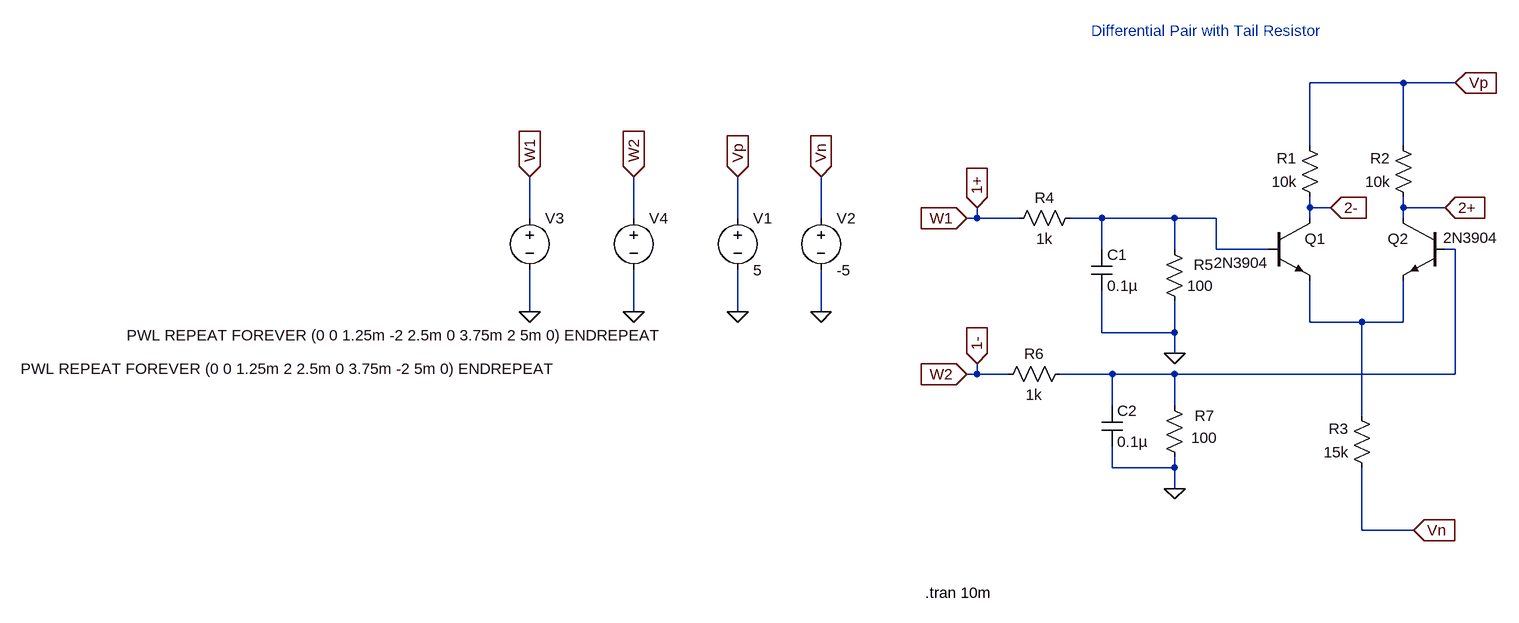
[diagram p0: schematic diff_pair_tail_res_ltspice.asc]
diff_pair_tail_res_ltspice.asc, the LTspice schematic file:
Version 4
SHEET 1 1032 680
WIRE 864 -208 720 -208
WIRE 944 -208 864 -208
WIRE 720 -112 720 -208
WIRE 864 -112 864 -208
WIRE 720 -16 720 -32
WIRE 752 -16 720 -16
WIRE 864 -16 864 -32
WIRE 928 -16 864 -16
WIRE -480 0 -480 -64
WIRE -320 0 -320 -64
WIRE -160 0 -160 -64
WIRE -32 0 -32 -64
WIRE 208 0 208 -16
WIRE 208 0 192 0
WIRE 272 0 208 0
WIRE 400 0 352 0
WIRE 512 0 400 0
WIRE 576 0 512 0
WIRE 720 0 720 -16
WIRE 864 0 864 -16
WIRE 400 48 400 0
WIRE 512 48 512 0
WIRE 576 48 576 0
WIRE 656 48 576 48
WIRE 944 48 928 48
WIRE -480 144 -480 80
WIRE -320 144 -320 80
WIRE -160 144 -160 80
WIRE -32 144 -32 80
WIRE 720 160 720 96
WIRE 800 160 720 160
WIRE 864 160 864 96
WIRE 864 160 800 160
WIRE 400 176 400 112
WIRE 512 176 512 128
WIRE 512 176 400 176
WIRE 512 208 512 176
WIRE 208 240 208 224
WIRE 208 240 192 240
WIRE 256 240 208 240
WIRE 416 240 336 240
WIRE 512 240 416 240
WIRE 944 240 944 48
WIRE 944 240 512 240
WIRE 416 288 416 240
WIRE 512 288 512 240
WIRE 800 304 800 160
WIRE 416 384 416 352
WIRE 512 384 512 368
WIRE 512 384 416 384
WIRE 512 416 512 384
WIRE 800 480 800 384
WIRE 880 480 800 480
FLAG 512 208 0
FLAG 512 416 0
FLAG 944 -208 Vp
IOPIN 944 -208 In
FLAG 880 480 Vn
IOPIN 880 480 In
FLAG 192 0 W1
IOPIN 192 0 In
FLAG 192 240 W2
IOPIN 192 240 In
FLAG -160 144 0
FLAG -32 144 0
FLAG -480 144 0
FLAG -320 144 0
FLAG -160 -64 Vp
IOPIN -160 -64 In
FLAG -32 -64 Vn
IOPIN -32 -64 In
FLAG -480 -64 W1
IOPIN -480 -64 In
FLAG -320 -64 W2
IOPIN -320 -64 In
FLAG 928 -16 2+
IOPIN 928 -16 In
FLAG 208 -16 1+
IOPIN 208 -16 In
FLAG 208 224 1-
IOPIN 208 224 In
FLAG 752 -16 2-
IOPIN 752 -16 In
SYMBOL res 736 -16 R180
WINDOW 0 36 76 Left 2
WINDOW 3 36 40 Left 2
SYMATTR InstName R1
SYMATTR Value 10k
SYMBOL res 880 -16 R180
WINDOW 0 36 76 Left 2
WINDOW 3 36 40 Left 2
SYMATTR InstName R2
SYMATTR Value 10k
SYMBOL res 816 400 R180
WINDOW 0 36 76 Left 2
WINDOW 3 36 40 Left 2
SYMATTR InstName R3
SYMATTR Value 15k
SYMBOL res 256 16 R270
WINDOW 0 32 56 VTop 2
WINDOW 3 0 56 VBottom 2
SYMATTR InstName R4
SYMATTR Value 1k
SYMBOL res 528 144 R180
WINDOW 0 -44 72 Left 2
WINDOW 3 -44 40 Left 2
SYMATTR InstName R5
SYMATTR Value 100
SYMBOL res 240 256 R270
WINDOW 0 32 56 VTop 2
WINDOW 3 0 56 VBottom 2
SYMATTR InstName R6
SYMATTR Value 1k
SYMBOL res 528 384 R180
WINDOW 0 -46 80 Left 2
WINDOW 3 -50 46 Left 2
SYMATTR InstName R7
SYMATTR Value 100
SYMBOL npn 656 0 R0
WINDOW 3 -84 69 Left 2
SYMATTR Value 2N3904
SYMATTR InstName Q1
SYMBOL npn 928 0 M0
WINDOW 3 -82 30 Left 2
SYMATTR Value 2N3904
SYMATTR InstName Q2
SYMBOL cap 384 48 R0
SYMATTR InstName C1
SYMATTR Value 0.1µ
SYMBOL cap 400 288 R0
SYMATTR InstName C2
SYMATTR Value 0.1µ
SYMBOL voltage -160 -16 R0
WINDOW 123 0 0 Left 0
WINDOW 39 0 0 Left 0
SYMATTR InstName V1
SYMATTR Value 5
SYMBOL voltage -32 -16 R0
WINDOW 123 0 0 Left 0
WINDOW 39 0 0 Left 0
SYMATTR InstName V2
SYMATTR Value -5
SYMBOL voltage -480 -16 R0
WINDOW 3 41 248 Right 2
WINDOW 123 0 0 Left 0
WINDOW 39 0 0 Left 0
SYMATTR Value PWL REPEAT FOREVER (0 0 1.25m 2 2.5m 0 3.75m -2 5m 0) ENDREPEAT
SYMATTR InstName V3
SYMBOL voltage -320 -16 R0
WINDOW 3 -780 196 Left 2
WINDOW 123 0 0 Left 0
WINDOW 39 0 0 Left 0
SYMATTR Value PWL REPEAT FOREVER (0 0 1.25m -2 2.5m 0 3.75m 2 5m 0) ENDREPEAT
SYMATTR InstName V4
TEXT 128 576 Left 2 !.tran 10m
TEXT 384 -288 Left 2 ;Differential Pair with Tail Resistor

The netlist it stands for:
* diff_pair_tail_res_ltspice.asc
R1 2- Vp 10k
R2 2+ Vp 10k
R3 Vn N003 15k
R4 1+ N001 1k
R5 0 N001 100
R6 1- N002 1k
R7 0 N002 100
Q1 2- N001 N003 0 2N3904
Q2 2+ N002 N003 0 2N3904
C1 N001 0 0.1µ
C2 N002 0 0.1µ
V1 Vp 0 5
V2 Vn 0 -5
V3 1+ 0 PWL REPEAT FOREVER (0 0 1.25m 2 2.5m 0 3.75m -2 5m 0) ENDREPEAT
V4 1- 0 PWL REPEAT FOREVER (0 0 1.25m -2 2.5m 0 3.75m 2 5m 0) ENDREPEAT
.model NPN NPN
.model PNP PNP
.lib standard.bjt
.tran 10m
* Differential Pair with Tail Resistor
.backanno
.end